# Altium schematic sheet FNC_Necklace.SchDoc: NFC Necklace
size A; Author: Ilona Lameka; DrawnBy: Ilona Lameka; Engineer: Ilona Lameka; SheetNumber: 1; SheetTotal: 1
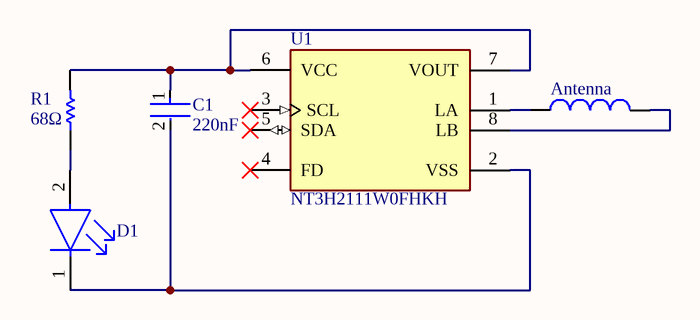
[diagram p0: FNC_Necklace.SchDoc]

## Parts
Antenna  NFC_antenna  [NFC_antenna-Footprint-1]  (value not drawn)
C1  Capacitance: 220nF  [FP-GRM155-0_05-IPC_C]  (hidden comment: GRM155R71C224KA12D)
D1  LO L29K-J2L1-24-Z  [FP-LO_L29K-MFG]  (value not drawn)
R1  Resistance: 68Ω  [RESC1609X50X30LL10T20]  (hidden comment: CRCW060368R0FKEA)
U1  NT3H2111W0FHKH  [FP-SOT902-3-MFG]

## Nets
NetAntenna_1: Antenna.1 U1.1(LA)
NetAntenna_2: Antenna.2 U1.8(LB)
NetC1_1: C1.1 R1.2 U1.6(VCC) U1.7(VOUT)
NetC1_2: C1.2 D1.1(C) U1.2(VSS)
NetD1_2: D1.2(A) R1.1

Not connected (* = marked no-connect by the designer): U1 3(SCL)* 4(FD)* 5(SDA)*

## Library data of the parts
Antenna = CMP-006-00025-1
C1 = CMP-1034-02089-3: Chip Multilayer Ceramic Capacitors for General Purpose, 0402, 0.22uF, X7R, 15%, 10%, 16V; Depth: 0.5mm; Dielectric: X7R; Min Operating Temperature: -55°C; Package Quantity: 1; Termination: SMD/SMT; Mount: Surface Mount; Radiation Hardening: No; Height: 0.5mm; Case Code (Metric): 1005; Packaging: Tape and Reel; Material: Ceramic; Voltage: 16V; Voltage Rating (DC): 16V; REACH SVHC: No SVHC; Voltage Rating: 16V; Length: 1mm; Tolerance: 10%; Thickness: 0.022inch; Case Code (Imperial): 0402; Max Operating Temperature: 125°C; Width: 0.02inch; Lead Free: Lead Free; Case/Package: 0402
D1 = CMP-62016-000043-1: LED ORANGE DIFFUSED 0603 SMD; Number of LEDs: 1; Forward Voltage: 1.8V; Forward Current: 20mA; Lens Color: White; Lens Size: 0.8mm; Test Current: 2mA; Lens Style: Flat; Wavelength: 610nm; Luminous Intensity: 9.8mcd; Viewing Angle: 160°; Luminous Flux: 0.04lm; Dominant Wavelength: 606nm; Case Code (Imperial): 0603; Package Quantity: 5000; Max Operating Temperature: 100°C; Min Operating Temperature: -40°C; Mount: Surface Mount; Illumination Color: Orange; Length: 1.7mm; Lead Free: Lead Free; Case Code (Metric): 1608; Number of Pins: 2; Case/Package: 0603; Lens Transparency: Diffused; Width: 0.8mm; Color: Orange; Height: 0.65mm; Packaging: Tape and Reel
R1 = CMP-2000-03536-1: Manufacturer: Vishay Dale; Part Number: CRCW060368R0FKEA
U1 = CMP-10079-000001-1: IC RFID TRANSP 13.56MHZ 8XQFN; Manufacturer: NXP; Max Junction Temp: +105°C; Standoff Height: 0mm; Temperature Range Low: -40°C; Package: SOT902-3; Ambient Temperature Range High: +105°C; Height: 0.5mm; Digikey Description: IC RFID TRANSP 13.56MHZ 8XQFN; ComponentLink2URL: https://www.nxp.com/docs/en/data-sheet/NT3H2111_2211.pdf; ComponentLink2Description: Datasheet; Footprint Url: https://www.nxp.com/docs/en/package-information/SOT902-3.pdf; RoHS: TRUE; Automotive: No; Category: IC; Temperature Range High: +105°C; Octopart: https://octopart.com/nt3h2111w0fhkh-nxp+semiconductors-71112033; Device Class L2: unset; Lead Free: Yes; Device Class L3: unset; Temperature: -40°C to +105°C; Ambient Temperature Range Low: -40°C; Mouser Description: NFC/RFID Tag and Transponder IC 13560kHz 1KByte 8-Pin XQFN EP T/R; Device Class L1: Integrated Circuits (ICs); Manufacturer Part Number: NT3H2111W0FHKH